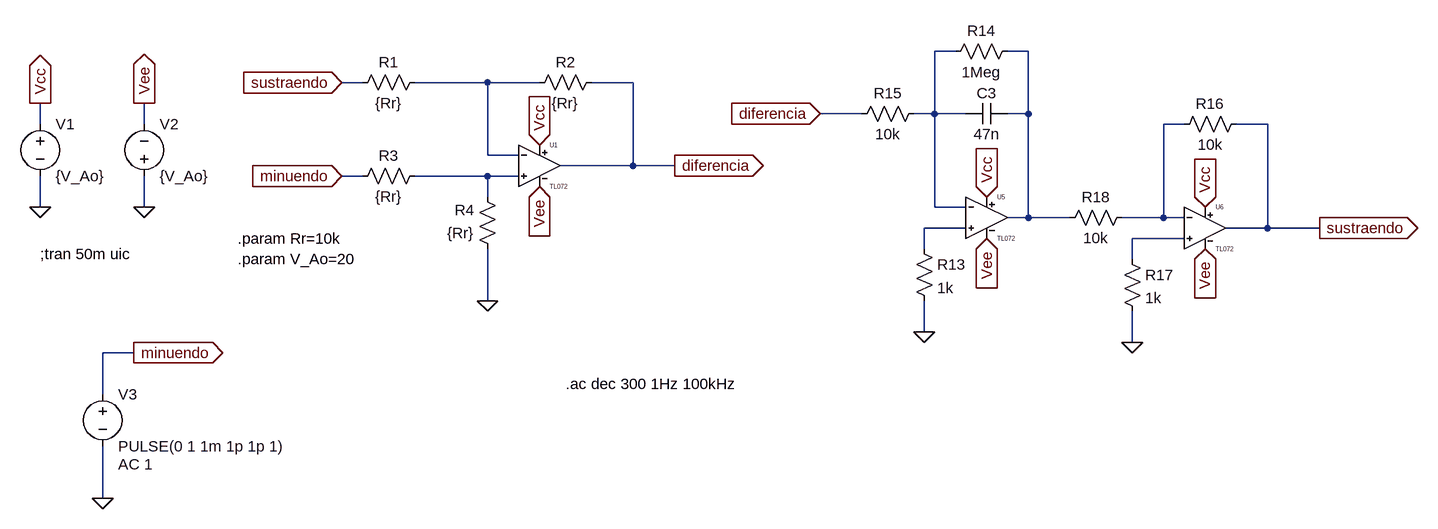
[diagram p0: schematic lazo_integrador.asc]
lazo_integrador.asc, the LTspice schematic file:
Version 4
SHEET 1 2148 680
WIRE 464 -368 432 -368
WIRE 576 -368 544 -368
WIRE -448 -320 -480 -320
WIRE -256 -320 -368 -320
WIRE -176 -320 -256 -320
WIRE -32 -320 -96 -320
WIRE 320 -272 256 -272
WIRE 432 -272 432 -368
WIRE 432 -272 400 -272
WIRE 480 -272 432 -272
WIRE 576 -272 576 -368
WIRE 576 -272 544 -272
WIRE -944 -256 -944 -288
WIRE -784 -256 -784 -288
WIRE 816 -256 784 -256
WIRE 944 -256 896 -256
WIRE -256 -208 -256 -320
WIRE -208 -208 -256 -208
WIRE -32 -192 -32 -320
WIRE -32 -192 -144 -192
WIRE 32 -192 -32 -192
WIRE -448 -176 -480 -176
WIRE -256 -176 -368 -176
WIRE -208 -176 -256 -176
WIRE -256 -144 -256 -176
WIRE -944 -128 -944 -176
WIRE -784 -128 -784 -176
WIRE 432 -128 432 -272
WIRE 480 -128 432 -128
WIRE 576 -112 576 -272
WIRE 576 -112 544 -112
WIRE 640 -112 576 -112
WIRE 784 -112 784 -256
WIRE 784 -112 720 -112
WIRE 816 -112 784 -112
WIRE 480 -96 416 -96
WIRE 944 -96 944 -256
WIRE 944 -96 880 -96
WIRE 1024 -96 944 -96
WIRE 816 -80 736 -80
WIRE 416 -64 416 -96
WIRE 736 -48 736 -80
WIRE -256 16 -256 -64
WIRE 416 64 416 16
WIRE 736 80 736 32
WIRE -800 96 -848 96
WIRE -848 160 -848 96
WIRE -848 320 -848 240
FLAG -176 -224 Vcc
IOPIN -176 -224 In
FLAG -176 -160 Vee
IOPIN -176 -160 In
FLAG -944 -128 0
FLAG -784 -128 0
FLAG -784 -288 Vee
IOPIN -784 -288 Out
FLAG -944 -288 Vcc
IOPIN -944 -288 Out
FLAG -256 16 0
FLAG -480 -320 sustraendo
IOPIN -480 -320 In
FLAG -480 -176 minuendo
IOPIN -480 -176 In
FLAG 32 -192 diferencia
IOPIN 32 -192 Out
FLAG -848 320 0
FLAG -800 96 minuendo
IOPIN -800 96 Out
FLAG 512 -144 Vcc
IOPIN 512 -144 In
FLAG 512 -80 Vee
IOPIN 512 -80 In
FLAG 416 64 0
FLAG 848 -128 Vcc
IOPIN 848 -128 In
FLAG 848 -64 Vee
IOPIN 848 -64 In
FLAG 736 80 0
FLAG 1024 -96 sustraendo
IOPIN 1024 -96 Out
FLAG 256 -272 diferencia
IOPIN 256 -272 In
SYMBOL Opamps\\TL072 -176 -256 R0
SYMATTR InstName U1
SYMBOL voltage -944 -272 R0
SYMATTR InstName V1
SYMATTR Value {V_Ao}
SYMBOL voltage -784 -160 M180
WINDOW 0 24 96 Left 2
WINDOW 3 24 16 Left 2
SYMATTR InstName V2
SYMATTR Value {V_Ao}
SYMBOL res -352 -336 R90
WINDOW 0 0 56 VBottom 2
WINDOW 3 32 56 VTop 2
SYMATTR InstName R1
SYMATTR Value {Rr}
SYMBOL res -80 -336 R90
WINDOW 0 0 56 VBottom 2
WINDOW 3 32 56 VTop 2
SYMATTR InstName R2
SYMATTR Value {Rr}
SYMBOL res -352 -192 R90
WINDOW 0 0 56 VBottom 2
WINDOW 3 32 56 VTop 2
SYMATTR InstName R3
SYMATTR Value {Rr}
SYMBOL res -240 -48 R180
WINDOW 0 36 76 Left 2
WINDOW 3 36 40 Left 2
SYMATTR InstName R4
SYMATTR Value {Rr}
SYMBOL voltage -848 144 R0
WINDOW 123 24 124 Left 2
WINDOW 39 0 0 Left 0
SYMATTR Value2 AC 1
SYMATTR InstName V3
SYMATTR Value PULSE(0 1 1m 1p 1p 1)
SYMBOL Opamps\\TL072 512 -176 R0
SYMATTR InstName U5
SYMBOL cap 544 -288 R90
WINDOW 0 0 32 VBottom 2
WINDOW 3 32 32 VTop 2
SYMATTR InstName C3
SYMATTR Value 47n
SYMBOL res 400 -80 R0
SYMATTR InstName R13
SYMATTR Value 1k
SYMBOL res 560 -384 R90
WINDOW 0 0 56 VBottom 2
WINDOW 3 32 56 VTop 2
SYMATTR InstName R14
SYMATTR Value 1Meg
SYMBOL res 416 -288 R90
WINDOW 0 0 56 VBottom 2
WINDOW 3 32 56 VTop 2
SYMATTR InstName R15
SYMATTR Value 10k
SYMBOL Opamps\\TL072 848 -160 R0
SYMATTR InstName U6
SYMBOL res 912 -272 R90
WINDOW 0 0 56 VBottom 2
WINDOW 3 32 56 VTop 2
SYMATTR InstName R16
SYMATTR Value 10k
SYMBOL res 720 -64 R0
SYMATTR InstName R17
SYMATTR Value 1k
SYMBOL res 736 -128 R90
WINDOW 0 0 56 VBottom 2
WINDOW 3 32 56 VTop 2
SYMATTR InstName R18
SYMATTR Value 10k
TEXT -640 -80 Left 2 !.param Rr=10k
TEXT -640 -48 Left 2 !.param V_Ao=20
TEXT -944 -56 Left 2 !;tran 50m uic
TEXT -136 144 Left 2 !.ac dec 300 1Hz 100kHz

The netlist it stands for:
* lazo_integrador.asc
XU1 N005 N003 Vcc Vee diferencia TL072  ; pins In+ In- V+ V- OUT
V1 Vcc 0 {V_Ao}
V2 0 Vee {V_Ao}
R1 N003 sustraendo {Rr}
R2 diferencia N003 {Rr}
R3 N005 minuendo {Rr}
R4 0 N005 {Rr}
V3 minuendo 0 PULSE(0 1 1m 1p 1p 1) AC 1
XU5 N006 N001 Vcc Vee N002 TL072  ; pins In+ In- V+ V- OUT
C3 N002 N001 47n
R13 N006 0 1k
R14 N002 N001 1Meg
R15 N001 diferencia 10k
XU6 N007 N004 Vcc Vee sustraendo TL072  ; pins In+ In- V+ V- OUT
R16 sustraendo N004 10k
R17 N007 0 1k
R18 N004 N002 10k
.param Rr=10k
.param V_Ao=20
;tran 50m uic
.ac dec 300 1Hz 100kHz
.lib TL072.sub
.backanno
.end